# Altium schematic sheet [12] - CONNECTOR.SchDoc
size A4; Size: A4; Contact: datasystem.pl
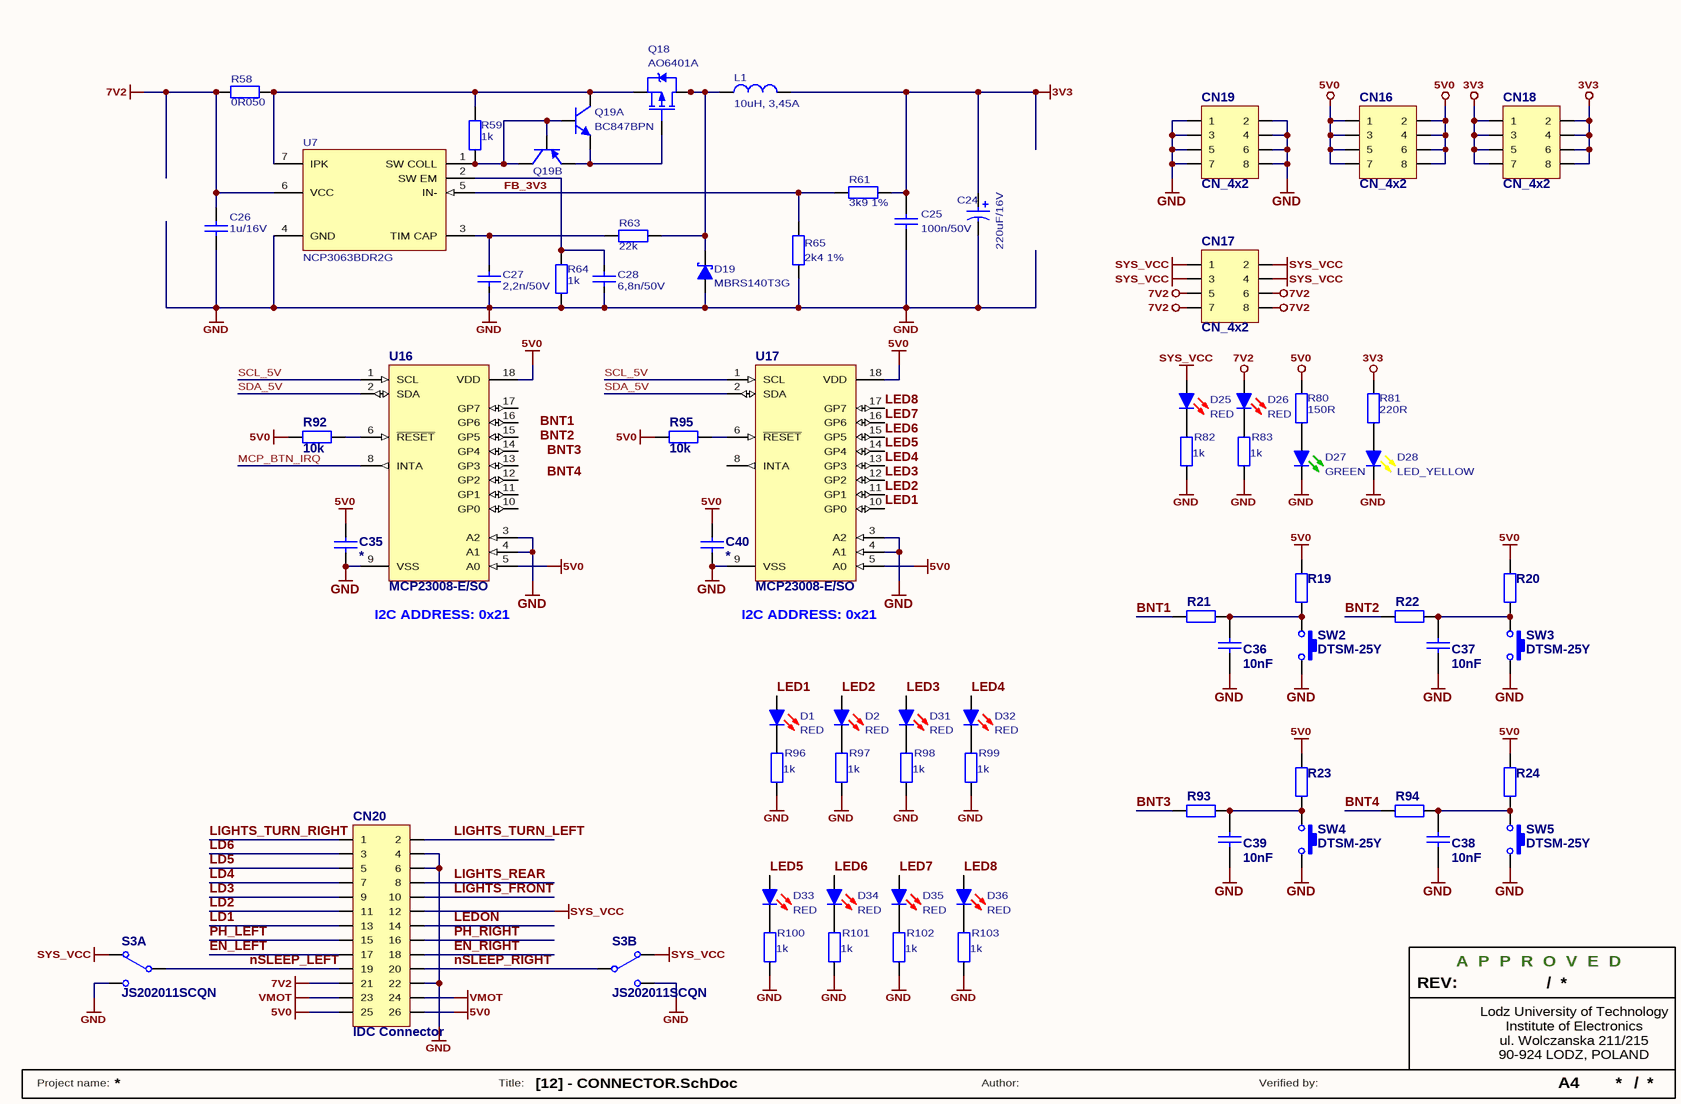
[diagram p0: [12] - CONNECTOR.SchDoc]

## Parts
C24  220uF/16V  [CES_E_8.3x8.3_6.2]
C25  100n/50V  [C0805]
C26  1u/16V  [C0805]
C27  2,2n/50V  [C0805]
C28  6,8n/50V  [C0805]
C35  *  [C0805]
C36  10nF  [C0805]
C37  10nF  [C0805]
C38  10nF  [C0805]
C39  10nF  [C0805]
C40  *  [C0805]
CN16  CN_4x2  [GP_4x2]
CN17  CN_4x2  [GP_4x2]
CN18  CN_4x2  [GP_4x2]
CN19  CN_4x2  [GP_4x2]
CN20  IDC Connector  [IDC26_RA]
D1  RED  [LED0805R]
D2  RED  [LED0805R]
D19  MBRS140T3G  [SMB]
D25  RED  [LED0805R]
D26  RED  [LED0805R]
D27  GREEN  [LED0805G]
D28  LED_YELLOW  [LED0805Y]
D31  RED  [LED0805R]
D32  RED  [LED0805R]
D33  RED  [LED0805R]
D34  RED  [LED0805R]
D35  RED  [LED0805R]
D36  RED  [LED0805R]
L1  10uH, 3,45A  [PSDB1005]
Q18  AO6401A  [SOT-23-6]
Q19  BC847BPN  [SOT-323-6 (SOT-363, SC88, SC70-6)]  (parts A,B of 2)
R19  (no value)  [R0805]
R20  (no value)  [R0805]
R21  (no value)  [R0805]
R22  (no value)  [R0805]
R23  (no value)  [R0805]
R24  (no value)  [R0805]
R58  0R050  [R0805]
R59  1k  [R0805]
R61  3k9 1%  [R0805]
R63  22k  [R0805]
R64  1k  [R0805]
R65  2k4 1%  [R0805]
R80  150R  [R0805]
R81  220R  [R0805]
R82  1k  [R0805]
R83  1k  [R0805]
R92  10k  [R0805]
R93  (no value)  [R0805]
R94  (no value)  [R0805]
R95  10k  [R0805]
R96  1k  [R0805]
R97  1k  [R0805]
R98  1k  [R0805]
R99  1k  [R0805]
R100  1k  [R0805]
R101  1k  [R0805]
R102  1k  [R0805]
R103  1k  [R0805]
S3  JS202011SCQN  [JS202011SCQN]  (parts A,B of 2)
SW2  DTSM-25Y  [DTSM-25Y]
SW3  DTSM-25Y  [DTSM-25Y]
SW4  DTSM-25Y  [DTSM-25Y]
SW5  DTSM-25Y  [DTSM-25Y]
U7  NCP3063BDR2G  [SO8]
U16  MCP23008-E/SO  [SO18W]
U17  MCP23008-E/SO  [SO18W]

## Nets
3V3: C24.1 C25.2 CN18.1 CN18.2 CN18.3 CN18.4 CN18.5 CN18.6 CN18.7 CN18.8 L1.2 R61.2 R81.1
5V0: C35.2 C40.2 CN16.1 CN16.2 CN16.3 CN16.4 CN16.5 CN16.6 CN16.7 CN16.8 CN20.25 CN20.26 R19.2 R20.2 R23.2 R24.2 R80.1 R92.1 R95.1 U16.5(A0) U16.18(VDD) U17.5(A0) U17.18(VDD)
7V2: C26.2 CN17.5 CN17.6 CN17.7 CN17.8 CN20.21 D26.1(A) R58.1 U7.6(VCC)
GND: C24.2 C25.1 C26.1 C27.1 C28.1 C35.1 C36.1 C37.1 C38.1 C39.1 C40.1 CN19.1 CN19.2 CN19.3 CN19.4 CN19.5 CN19.6 CN19.7 CN19.8 CN20.4 CN20.6 CN20.22 D19.1(A) D27.2(K) D28.2(K) R64.2 R65.2 R82.2 R83.2 R96.2 R97.2 R98.2 R99.2 R100.2 R101.2 R102.2 R103.2 S3.3(NO1) S3.6(NO2) SW2.2 SW3.2 SW4.2 SW5.2 U7.4(GND) U16.3(A2) U16.4(A1) U16.9(VSS) U17.3(A2) U17.4(A1) U17.9(VSS)
SYS_VCC: CN17.1 CN17.2 CN17.3 CN17.4 CN20.12 D25.1(A) S3.2(NC1) S3.4(NC2)
VMOT: CN20.23 CN20.24
BNT1: R21.1
BNT2: R22.1
BNT3: R93.1
BNT4: R94.1
EN_LEFT: CN20.17
EN_RIGHT: CN20.18
FB_3V3: R61.1 R65.1 U7.5(IN-)
LD1: CN20.13
LD2: CN20.11
LD3: CN20.9
LD4: CN20.7
LD5: CN20.5
LD6: CN20.3
LED1: D1.1(A) U17.10(GP0)
LED2: D2.1(A) U17.11(GP1)
LED3: D31.1(A) U17.12(GP2)
LED4: D32.1(A) U17.13(GP3)
LED5: D33.1(A) U17.14(GP4)
LED6: D34.1(A) U17.15(GP5)
LED7: D35.1(A) U17.16(GP6)
LED8: D36.1(A) U17.17(GP7)
LEDON: CN20.14
LIGHTS_FRONT: CN20.10
LIGHTS_REAR: CN20.8
LIGHTS_TURN_LEFT: CN20.2
LIGHTS_TURN_RIGHT: CN20.1
MCP_BTN_IRQ: U16.8(INTA)
nSLEEP_LEFT: CN20.19 S3.1(COMMON1)
nSLEEP_RIGHT: CN20.20 S3.5(COMMON2)
PH_LEFT: CN20.15
PH_RIGHT: CN20.16
SCL_5V: U16.1(SCL) U17.1(SCL)
SDA_5V: U16.2(SDA) U17.2(SDA)
NetC27_2: C27.2 R63.2 U7.3(TIM_CAP)
NetC28_2: C28.2 R64.1 U7.2(SW_EM)
NetC36_2: C36.2 R19.1 R21.2 SW2.1
NetC37_2: C37.2 R20.1 R22.2 SW3.1
NetC38_2: C38.2 R24.1 R94.2 SW5.1
NetC39_2: C39.2 R23.1 R93.2 SW4.1
NetD1_2: D1.2(K) R96.1
NetD2_2: D2.2(K) R97.1
NetD19_2: D19.2(K) L1.1 Q18.1(D) Q18.2(D) Q18.5(D) Q18.6(D) R63.1
NetD25_2: D25.2(K) R82.1
NetD26_2: D26.2(K) R83.1
NetD27_1: D27.1(A) R80.2
NetD28_1: D28.1(A) R81.2
NetD31_2: D31.2(K) R98.1
NetD32_2: D32.2(K) R99.1
NetD33_2: D33.2(K) R100.1
NetD34_2: D34.2(K) R101.1
NetD35_2: D35.2(K) R102.1
NetD36_2: D36.2(K) R103.1
NetQ18_3: Q18.3(G) Q19.1(EA) Q19.4(EB)
NetQ18_4: Q18.4(S) Q19.6(CA) R58.2 R59.1 U7.7(IPK)
NetQ19_2: Q19.2(BA) Q19.3(CB) Q19.5(BB) R59.2 U7.1(SW_COLL)
NetR92_2: R92.2 U16.6(~{RESET})
NetR95_2: R95.2 U17.6(~{RESET})

Not connected (* = marked no-connect by the designer): U16 10(GP0) 11(GP1) 12(GP2) 13(GP3) 14(GP4) 15(GP5) 16(GP6) 17(GP7); U17 8(INTA)

## Notes on the sheet
- I2C ADDRESS: 0x21
- Labels drawn without touching a wire or pin: BNT1, BNT2, BNT3, BNT4
- REV:
- A  P  P  R  O  V  E  D
- /
- Lodz University of Technology
- ul. Wolczanska 211/215
- 90-924 LODZ, POLAND
- Institute of Electronics
- Project name:
- Title:
- Author:
- Verified by:

## Library data of the parts
C24 = Cap Pol: Polarized Capacitor; ComponentLink1Description: datasheet; ComponentLink2Description: supplier; Value: 220uF/16V
C25-C28 C35-C40 = Cap: Capacitor; ComponentLink1Description: datasheet; ComponentLink2Description: supplier
  C25: Value: 100n/50V
  C26: Value: 1u/16V
  C27: Value: 2,2n/50V
  C28: Value: 6,8n/50V
  C35 C40: Value: *
  C36-C39: Value: 10nF
CN20 = CN_13x2
D1 D2 D25 D26 D31-D36 = LED_RED: RED LED; Published: 04-Apr-2006
D19 = MBRS140T3G: Schottky barrier rectifier: 40V, 1A; Published: 22-Nov-2006; PackageReference: SMB; Supplier 1: TME; Supplier 2: Farnell; Supplier Part Number 1: MBRS140T3G; Supplier Part Number 2: 1467526
D27 = LED_GREEN: GREEN LED; Published: 04-Apr-2006
D28 = LED_YELLOW: YELLOW LED; Published: 04-Apr-2006
L1 = PSDB1005NT100: 10uH, 20%, 3,45A, PSDB1005N Series Inductor; Published: 08-Mar-2006; ComponentLink1Description: datasheet; ComponentLink2Description: supplier; Supplier 1: TME; Supplier Part Number 1: PSDB1005NT100; Value: 10uH, 3,45A
Q18 = AO6401A: P-Channel MOSFET; -60V, -5A, 1.3W;; Supplier 1: TME; Supplier Part Number 1: AO6401A
Q19 = BC847BPN: PNP/NPN General Purpose Transistor (VCE=45V, IC=100mA); Supplier 1: TME; Supplier 2: Farnell; Supplier 3: Farnell; Supplier 4: Farnell; Supplier Part Number 1: BC847BPN.115; Supplier Part Number 2: 2336824; Supplier Part Number 3: 1081233RL; Supplier Part Number 4: 1081233
R19-R24 R58 R59 R61 R63-R65 R80-R83 R92-R103 = Res: Resistor; Published: 19-Feb-2006; ComponentLink1Description: datasheet; ComponentLink2Description: supplier
  R58: Value: 0R050
  R59 R64 R82 R83 R96-R103: Value: 1k
  R61: Value: 3k9 1%
  R63: Value: 22k
  R65: Value: 2k4 1%
  R80: Value: 150R
  R81: Value: 220R
  R92 R95: Value: 10k
S3 = JS202011SCQN: C&K JS202011SCQN DPDT Switch; Published: 24-Mar-1999; Revision: July-2002: Re-released for DXP Platform.; Publisher: Altium Limited; Supplier 1: Farnell; Supplier 2: Farnell; Supplier Part Number 1: 2320019RL; Supplier Part Number 2: 2320019
SW2-SW5 = DTSM-25Y: DIPTRONICS Yellow 12x12mm SMD Tactile SPST-NO Switch; Supplier 1: TME; Supplier Part Number 1: DTSM-25Y-V-B
U7 = NCP3063BDR2G: DC-DC Converter NCP3063BDR2G (Farnell 1547126); Published: 22-Nov-2006; PackageReference: SO8; Supplier 1: Farnell; Supplier 2: Farnell; Supplier 3: Farnell; Supplier Part Number 1: 1547126; Supplier Part Number 2: 2126136; Supplier Part Number 3: 1547126RL
U16 U17 = MCP23008-E/SO: 8-Bit I/O Expander with Serial Interface I2C, 18-Pin SOIC Package